# EAGLE design P01R0 (EAGLE 9.6.1)

## Sheet 1 of 2
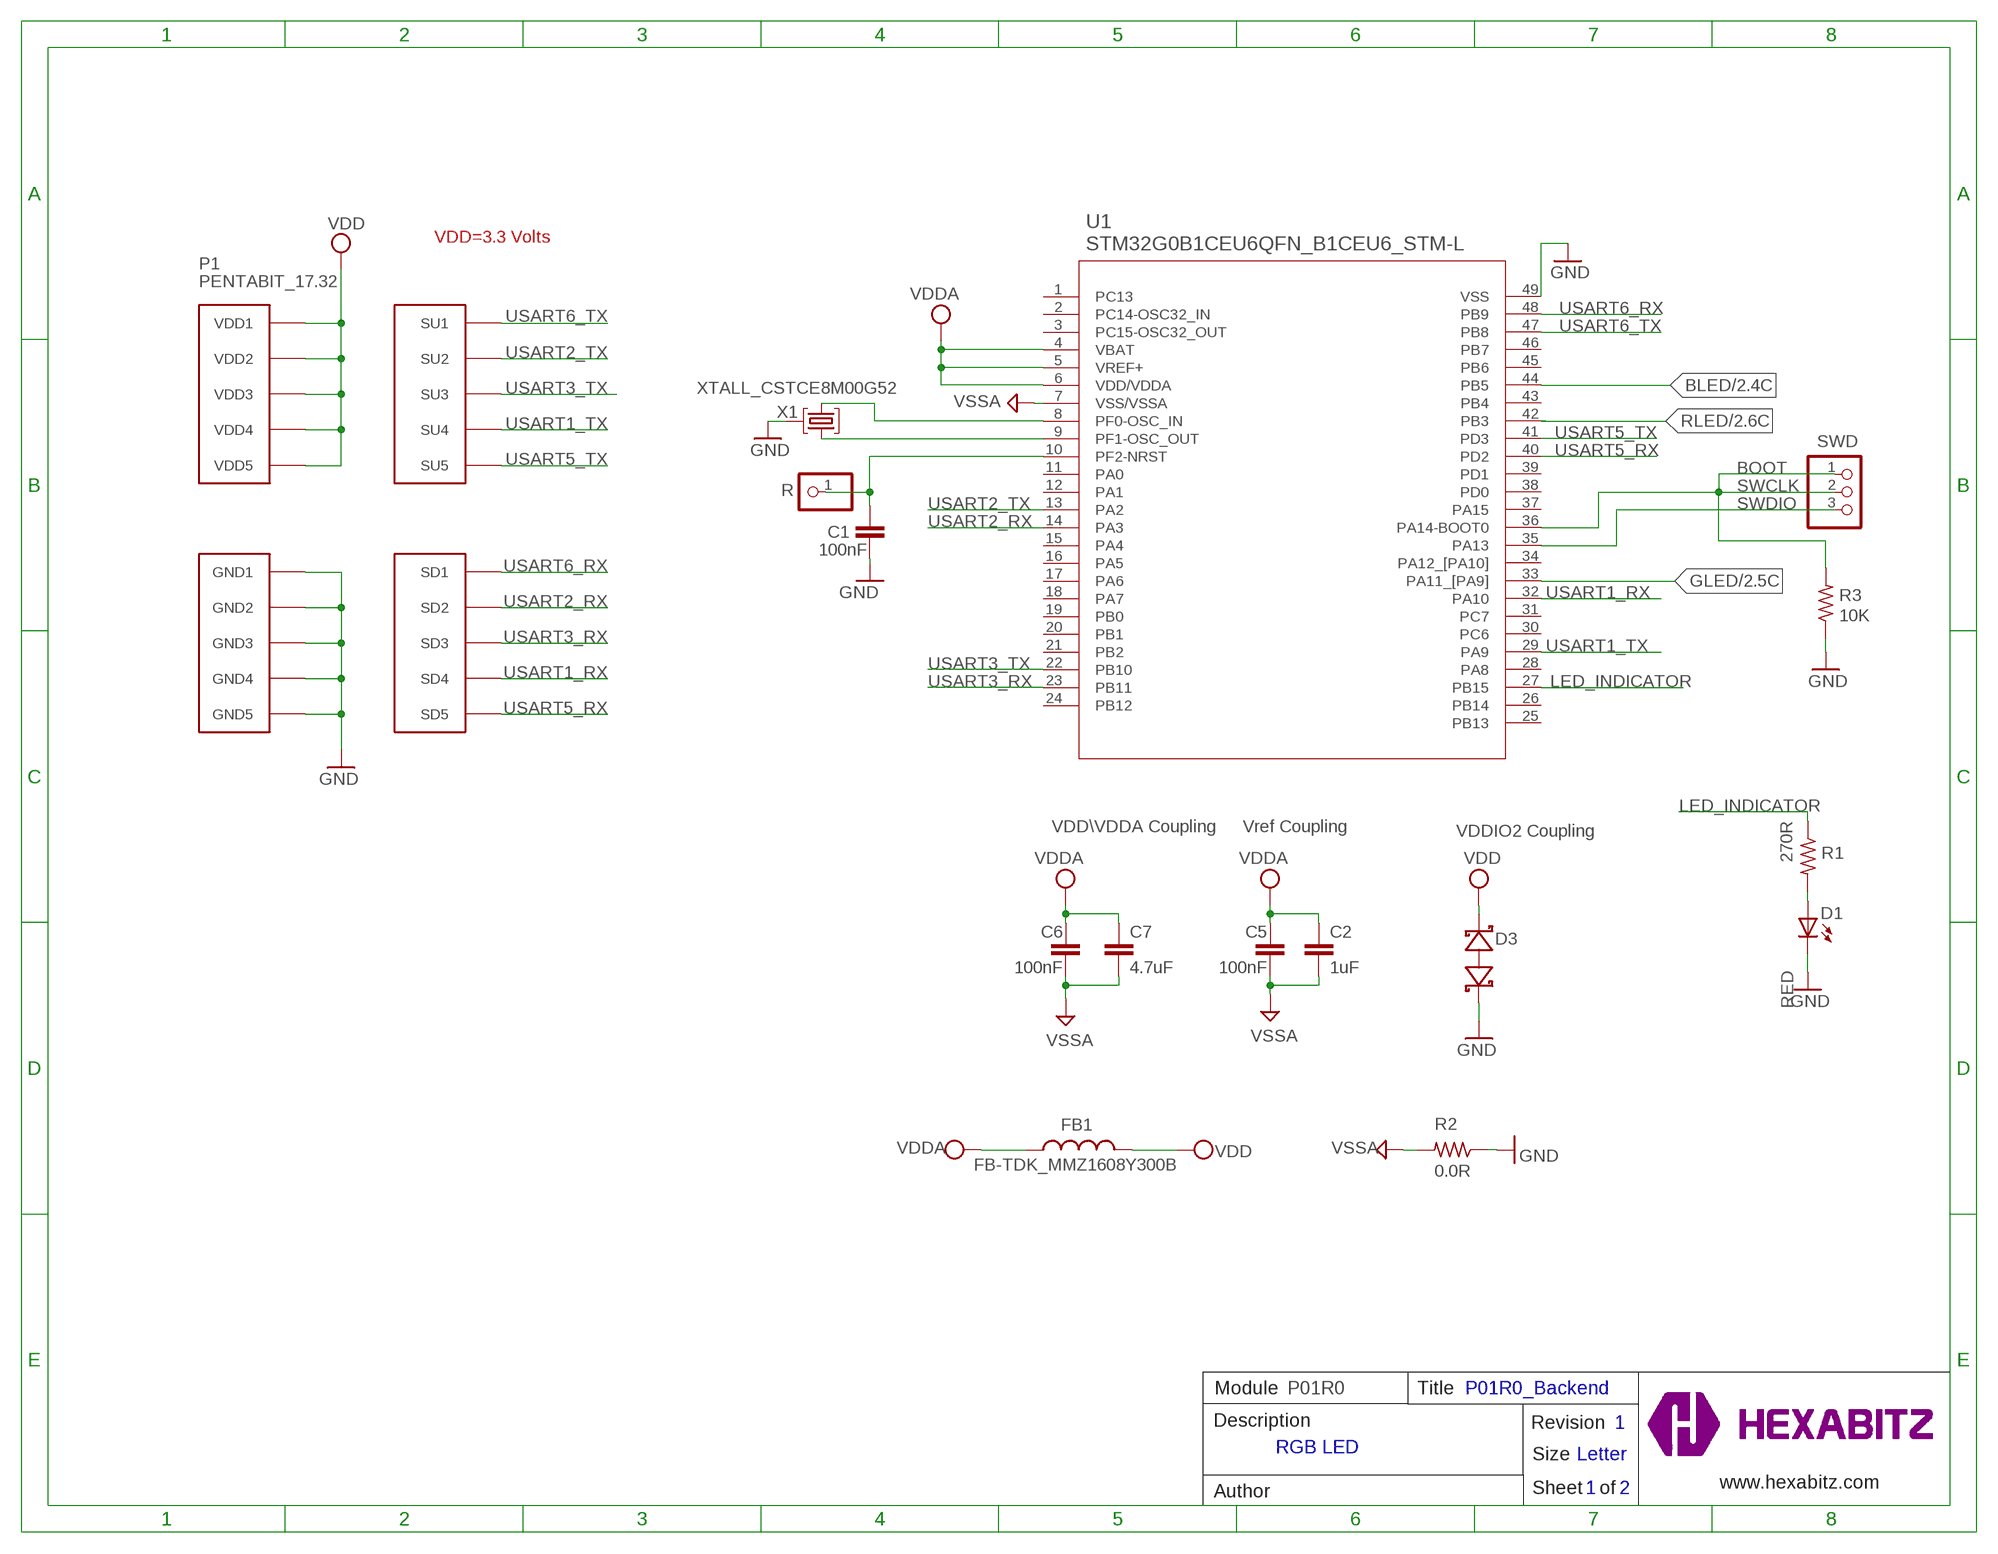
[diagram p0: schematic, sheet 1]

### Parts
C1  100nF  C-0603  [C-0603]
C2  1uF  C-0805  [C-0805]
C5  100nF  C-0603  [C-0603]
C6  100nF  C-0603  [C-0603]
C7  4.7uF  C-0805  [C-0805]
D1  RED  VLMS1300-GS08  [VLMS1300-GS08]
D3  BOURNS_CDSOD323-T03SCBOURNS_CDSOD323-T03SC_0_0  [BOURNS_CDSOD323-T03SC_0]
FB1  FB-TDK_MMZ1608Y300B  FB-0603  [FB-0603]
P1  PENTABIT_17.32  [PENTABIT_17.32]
R  R  PINHD-1X1  [1X01]
R1  270R  R-0603  [R-0603]
R2  0.0R  R-0603  [R-0603]
R3  10K  R-0603  [R-0603]
SWD  PINHD-1X3  [1X03]
U1  STM32G0B1CEU6QFN_B1CEU6_STM-L  [QFN_B1CEU6_STM-L]
X1  XTALL_CSTCE8M00G52  [XTALL_CSTCE8M00G52]

### Nets
BLED: U1.44(PB5) ; also sheet 2
GLED: U1.33(PA11_[PA9]) ; also sheet 2
GND: C1.2 D1.C D3.1(A) P1.PAD_PD6(GND1) P1.PAD_PD7(GND2) P1.PAD_PD8(GND3) P1.PAD_PD9(GND4) P1.PAD_PD10(GND5) R2.1 R3.1 U1.49(VSS) X1.P$2 ; also sheet 2
LED_INDICATOR: R1.1 U1.27(PB15)
N$3: D1.A R1.2
OSC_IN: U1.8(PF0-OSC_IN) X1.P$3
OSC_OUT: U1.9(PF1-OSC_OUT) X1.P$1
R: C1.1 R.1 U1.10(PF2-NRST)
RLED: U1.42(PB3) ; also sheet 2
SWCLK: R3.2 SWD.1 SWD.2 U1.36(PA14-BOOT0)
SWDIO: SWD.3 U1.35(PA13)
USART1_RX: P1.PAD_PD4(SD4) U1.32(PA10)
USART1_TX: P1.PAD_PU4(SU4) U1.29(PA9)
USART2_RX: P1.PAD_PD2(SD2) U1.14(PA3)
USART2_TX: P1.PAD_PU2(SU2) U1.13(PA2)
USART3_RX: P1.PAD_PD3(SD3) U1.23(PB11)
USART3_TX: P1.PAD_PU3(SU3) U1.22(PB10)
USART5_RX: P1.PAD_PD5(SD5) U1.40(PD2)
USART5_TX: P1.PAD_PU5(SU5) U1.41(PD3)
USART6_RX: P1.PAD_PD1(SD1) U1.48(PB9)
USART6_TX: P1.PAD_PU1(SU1) U1.47(PB8)
VDD: D3.2(C) FB1.2 P1.PAD_PU6(VDD1) P1.PAD_PU7(VDD2) P1.PAD_PU8(VDD3) P1.PAD_PU9(VDD4) P1.PAD_PU10(VDD5) ; also sheet 2
VDDA: C2.1 C5.1 C6.1 C7.1 FB1.1 U1.4(VBAT) U1.5(VREF+) U1.6(VDD/VDDA)
VSSA: C2.2 C5.2 C6.2 C7.2 R2.2 U1.7(VSS/VSSA)
Unconnected: U1.1(PC13) U1.2(PC14-OSC32_IN) U1.3(PC15-OSC32_OUT) U1.11(PA0) U1.12(PA1) U1.15(PA4) U1.16(PA5) U1.17(PA6) U1.18(PA7) U1.19(PB0) U1.20(PB1) U1.21(PB2) U1.24(PB12) U1.25(PB13) U1.26(PB14) U1.28(PA8) U1.30(PC6) U1.31(PC7) U1.34(PA12_[PA10]) U1.37(PA15) U1.38(PD0) U1.39(PD1) U1.43(PB4) U1.45(PB6) U1.46(PB7)

### Notes on the sheet
- VDD=3.3 Volts
- BOOT
- VDD\VDDA Coupling | Vref Coupling | VDDIO2 Coupling
- Module | P01R0 | Title | P01R0_Backend
- Description | Revision | 1
- RGB LED
- Size | Letter
- www.hexabitz.com
- Author | Sheet   of | 1 | 2
- C:/Users/Admin/Desktop/logodraft.bmp

## Sheet 2 of 2
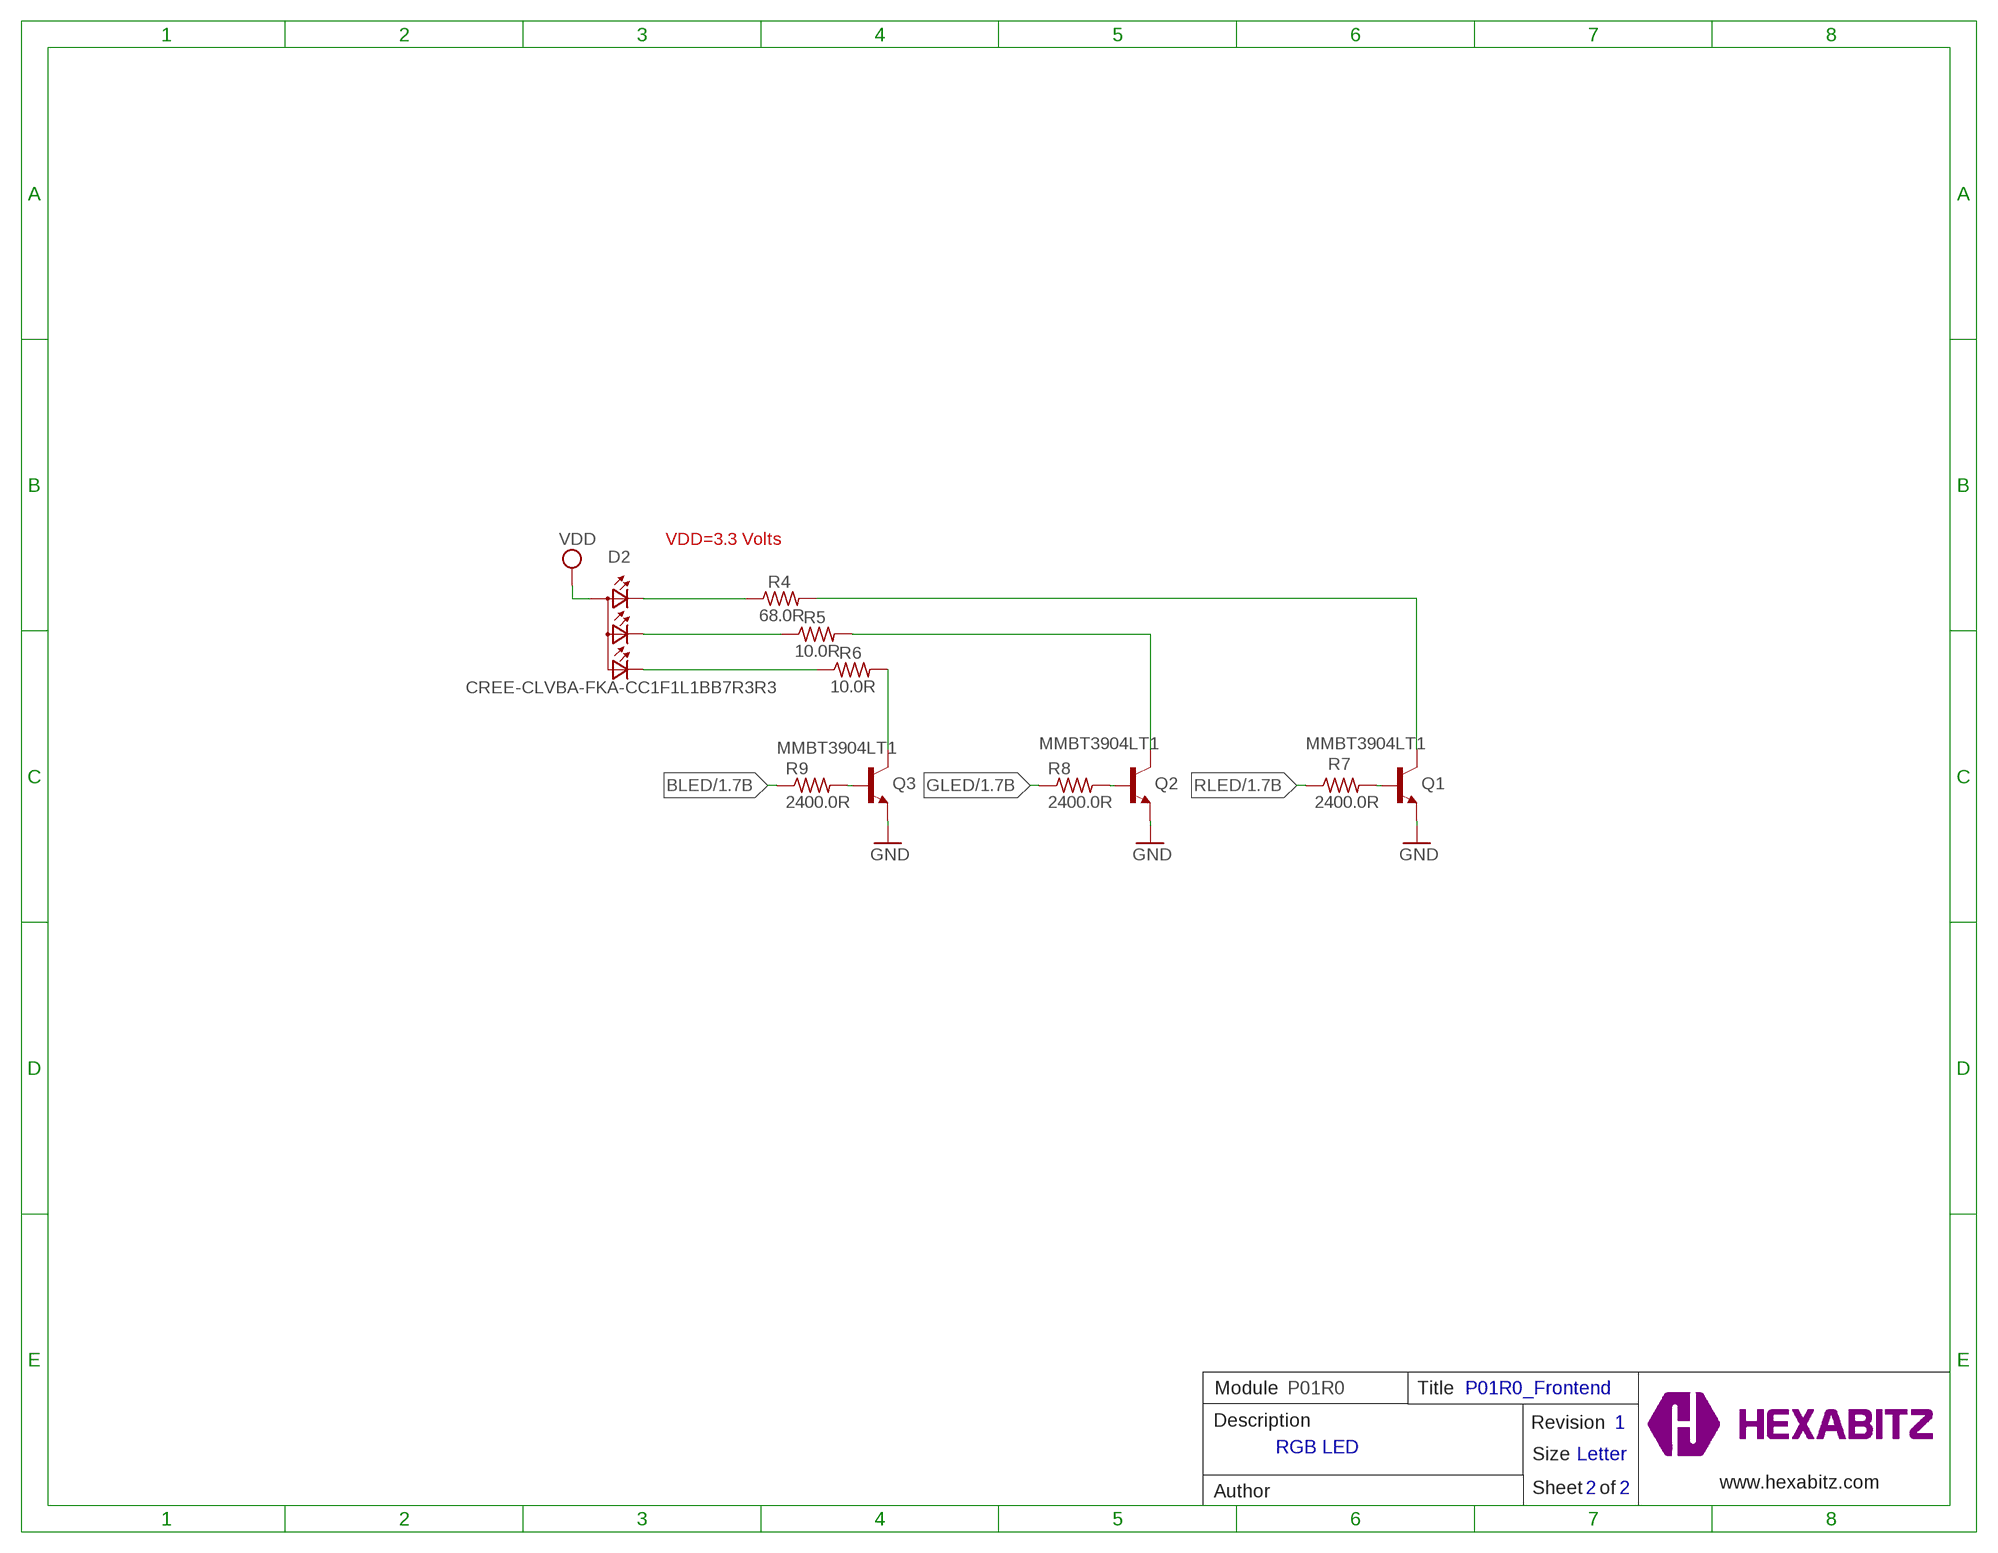
[diagram p1: schematic, sheet 2]

### Parts
D2  CREE-CLVBA-FKA-CC1F1L1BB7R3R3  [PCB-1023943-1]
Q1  MMBT3904LT1  [MMBT3904LT1]
Q2  MMBT3904LT1  [MMBT3904LT1]
Q3  MMBT3904LT1  [MMBT3904LT1]
R4  68.0R  R-0603  [R-0603]
R5  10.0R  R-0603  [R-0603]
R6  10.0R  R-0603  [R-0603]
R7  2400.0R  R-0603  [R-0603]
R8  2400.0R  R-0603  [R-0603]
R9  2400.0R  R-0603  [R-0603]
TRIMBLE-LOGO1  HEXA-LOGO  [HEXA-LOGO]

### Nets
BLED: R9.1 ; also sheet 1
GLED: R8.1 ; also sheet 1
GND: Q1.2(E) Q2.2(E) Q3.2(E) ; also sheet 1
KA_B: D2.P$3(CBLUE) R6.1
KA_G: D2.P$4(CGREEN) R5.1
KA_R: D2.P$1(CRED) R4.1
N$13: Q3.1(B) R9.2
N$14: Q2.1(B) R8.2
N$15: Q1.1(B) R7.2
Q1C: Q1.3(C) R4.2
Q2C: Q2.3(C) R5.2
Q3C: Q3.3(C) R6.2
RLED: R7.1 ; also sheet 1
VDD: D2.P$2(A2) ; also sheet 1

### Notes on the sheet
- VDD=3.3 Volts
- Module | P01R0 | Title | P01R0_Frontend
- Description | Revision | 1
- RGB LED
- Size | Letter
- www.hexabitz.com
- Author | Sheet   of | 2 | 2

## Library data of the parts
C1 C5 C6 = HEXABITZ_RCLS:C-0603: CAP CER 10% X7R 0603
C2 C7 = HEXABITZ_RCLS:C-0805: CAP CER 10% X7R 0805
D1 = Hexabitz:VLMS1300-GS08: Red 0603 130° Clear 54 mcd 2 V Surface Mount ChipLED ; Octopart Url : http://octopart.com/vlms1300-gs08-vishay-21709201; MFN: Vishay; MPN: VLMS1300-GS08; OCTOPART_URL: https://octopart.com/vlms1300-gs08-vishay-21709201?r=sp&s=_gcP4_q8T1SC6PJQPTQ9yA
D2 = Hexabitz:CREE-CLVBA-FKA-CC1F1L1BB7R3R3: CREE CLVBA-FKA-CC1F1L1BB7R3R3 LED, HB, RGB, SMD, 130mW; MFN: Cree, Inc.; MPN: CLVBA-FKA-CC1F1L1BB7R3R3; OCTOPART_URL: https://octopart.com/clvba-fka-cc1f1l1bb7r3r3-cree-20054005
D3 = HEXABITZ_RCLS:BOURNS_CDSOD323-T03SC: CDSOD323-TxxSC - TVS Diode Series; DESCRIPTION: Dio Tvs Vwm 03V 500W Bidir Sod323 / Tape & Reel - 7" Reel; MFN: Bourns; MPN: CDSOD323-T03SC; OCTOPART_URL: https://octopart.com/cdsod323-t03sc-bourns-10487153?r=sp
FB1 = HEXABITZ_RCLS:FB-0603: Ferrite Beads Multi-Layer 0603; MFN: TDK; MPN: MMZ1608Y300B; OCTOPART_URL: https://octopart.com/mmz1608y300b-tdk-368280?r=sp&s=cd9_2ZEqQ9q9UNBuQgHAiA
P1 = hexabitz_connectors:PENTABIT_?: Hexabitz Pentagon Module Connector Pentagon side length = 17.32mm.
Q1 Q2 = HEXABITZ_RCLS:MMBT3904LT1: TRANS NPN 40V 0.2A SOT23; MOUNTING_STYLE: Surface Mount; NUM_OF_PINS: 3; OCTOPART_ID: 0bb6c2bc2200d471; OCTOPART_URL: http://octopart.com/mmbt3904lt1g-on+semiconductor-3280; PACKAGE: SOT-23-3; PACKAGING: Reel; POLARITY: NPN; POWER_DISSIPATION: 0.225W; PRODUCT_CATEGORY: Transistors Bipolar-BJT; SERIES: MMBT3904L; VOLTAGE_RATING_DC: 40.0V
Q3 = HEXABITZ_RCLS:MMBT3904LT1: TRANS NPN 40V 0.2A SOT23; MFN: ON Semiconductor; MOUNTING_STYLE: Surface Mount; MPN: MMBT3904LT1G; NUM_OF_PINS: 3; OCTOPART_ID: 0bb6c2bc2200d471; OCTOPART_URL: http://octopart.com/mmbt3904lt1g-on+semiconductor-3280; PACKAGE: SOT-23-3; PACKAGING: Reel; POLARITY: NPN; POWER_DISSIPATION: 0.225W; PRODUCT_CATEGORY: Transistors Bipolar-BJT; SERIES: MMBT3904L; VOLTAGE_RATING_DC: 40.0V
R = HEXABITZ_USER_INTERFACE_PARTS:PINHD-1X1: PIN HEADER; MFN: TE Connectivity; MPN: 87227-1; OCTOPART_URL: https://octopart.com/87227-1-te+connectivity-39512052?r=sp
R1 R3 = HEXABITZ_RCLS:R-0603: Thick Film Resistors - SMD 0603
R2 = HEXABITZ_RCLS:R-0603: Thick Film Resistors - SMD 0603; MFN: Yageo; MPN: RC0603JR-070RL; OCTOPART_URL: https://octopart.com/rc0603jr-070rl-yageo-1241539?r=sp&s=X2NteqRjRNWrnx42Y0aliA; RESISTANCE: 0.0 Ohm
R4 = HEXABITZ_RCLS:R-0603: Thick Film Resistors - SMD 0603; MFN: Vishay; MPN: CRCW060368R0FKEA; OCTOPART_URL: https://octopart.com/crcw060368r0fkea-vishay-39811903; RESISTANCE: 68.0 Ω; SPICEPREFIX: R; TOLERANCE: 1%
R5 R6 = HEXABITZ_RCLS:R-0603: Thick Film Resistors - SMD 0603; MFN: Vishay; MPN: CRCW060310R0FKEB; OCTOPART_URL: https://octopart.com/crcw060310r0fkeb-vishay-42507905; RESISTANCE: 10.0 Ω; TOLERANCE: 1%
R7-R9 = HEXABITZ_RCLS:R-0603: Thick Film Resistors - SMD 0603; MFN: Vishay; MPN: CRCW06032K40JNEA; OCTOPART_URL: https://octopart.com/crcw06032k40jnea-vishay-40298967; RESISTANCE: 2400.0 Ω; TOLERANCE: 5%
SWD = HEXABITZ_CONNECTION_PARTS:PINHD-1X3: PIN HEADER
TRIMBLE-LOGO1 = HEXABITZ_USER_INTERFACE_PARTS:HEXA-LOGO: Trimble-Logo
U1 = HEXABITZ_ICs:STM32G0B1CEU6; COPYRIGHT: Copyright (C) 2021 Ultra Librarian. All rights reserved.; MANUFACTURER_PART_NUMBER: STM32G0B1CEU6; MFR_NAME: STMicroelectronics
X1 = Hexabitz:XTALL_CSTCE8M00G52: MURATA CSTCE8M00G52-R0 RESONATOR, SMD, 8MHZ ; Octopart Url : https://octopart.com/cstce8m00g52-r0-murata-7145559; MFN: Murata; MPN: CSTCE8M00G52Z-R0; OCTOPART_URL: https://octopart.com/cstce8m00g52z-r0-murata-17755941?r=sp&s=JDnNJnrHQhyS8Zk4ofFWXw

## Board
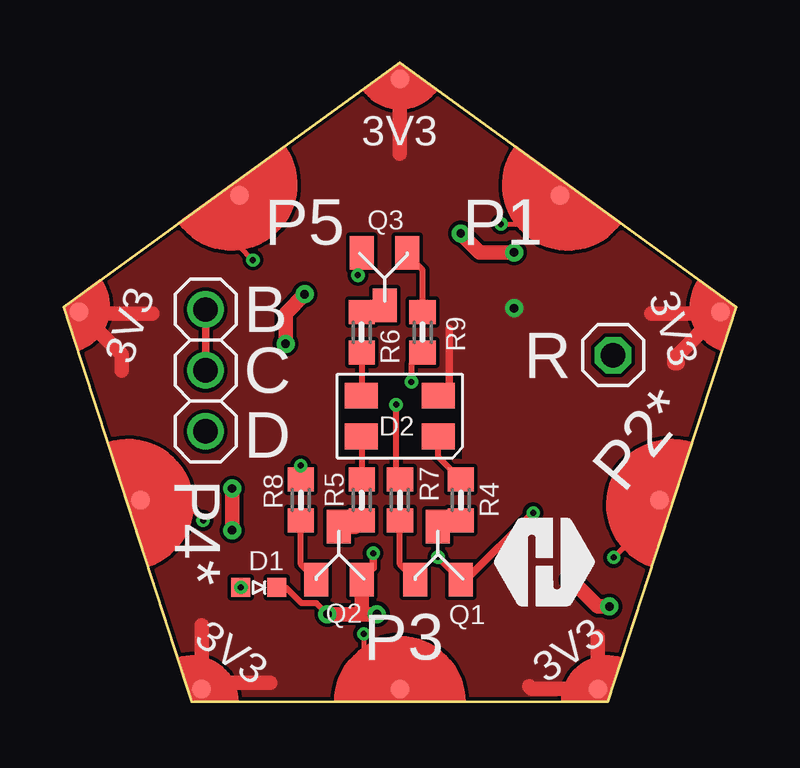
[diagram p2: board, top side]
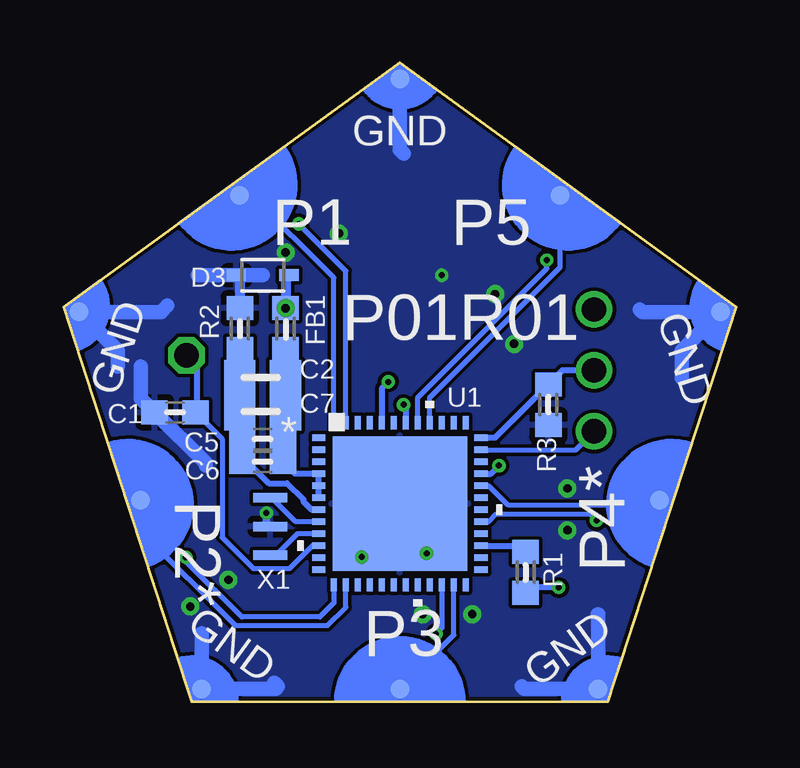
[diagram p3: board, bottom side, seen from below]

Size 28.02 x 26.65 mm. Coordinates in mm from the lower left corner, seen from the top.
Copper layers (1*16): Top 0.035mm / dielectric 1.5mm / Bottom 0.035mm
Design rules "Ibrahim *": minimum track width 6mil, minimum drill 0.25mm, track to track 6mil, track to pad 6mil, pad to pad 6mil, via to via 6mil, smd to smd 0mil, copper to edge 0.15mm, drill to drill 6mil, minimum pad ring 10mil, minimum via ring 6mil, stop-mask expansion 4mil, vias tented up to drill 24mil, thermal gap 10mil

### Footprints (pad centres in the part's own frame; a part is rotated, then mirrored left to right if it is on the bottom)
C-0603 = smd 1.1 x 1: 1 -0.85,0; 2 0.85,0
C-0805 = smd 1.3 x 1.5: 1 -0.95,0; 2 0.95,0
VLMS1300-GS08 = smd 0.8 x 0.8: A 0,0.75; C 0,-0.75
PCB-1023943-1 = smd 1.378 x 1.08: P$1 -1.604,0.85; P$2 -1.604,-0.85; P$3 1.604,-0.85; P$4 1.604,0.85
BOURNS_CDSOD323-T03SC_0 = smd 0.8 x 0.5: 1 -1.1,0; 2 1.1,0
FB-0603 = smd 1 x 1.1: 1 -0.85,0; 2 0.85,0
PENTABIT_17.32 = smd 0.8 x 0.8 bottom: PAD_PD1 6.68,9.2; PAD_PD2 10.81,-3.51; PAD_PD3 0,-11.37; PAD_PD4 -10.81,-3.51; PAD_PD5 -6.68,9.2; PAD_PD6 0,14.05; PAD_PD7 13.36,4.34; PAD_PD8 8.26,-11.37; PAD_PD9 -8.26,-11.37; PAD_PD10 -13.36,4.34 | smd 0.8 x 0.8: PAD_PU1 6.68,9.2; PAD_PU2 10.81,-3.51; PAD_PU3 0,-11.37; PAD_PU4 -10.81,-3.51; PAD_PU5 -6.68,9.2; PAD_PU6 0,14.05; PAD_PU7 13.36,4.34; PAD_PU8 8.26,-11.37; PAD_PU9 -8.26,-11.37; PAD_PU10 -13.36,4.34
MMBT3904LT1 = smd 1 x 1.4: 1 -0.95,-1.1; 2 0.95,-1.1; 3 0,1.1
1X01 = drill 1.016 octagon: 1 0,0
R-0603 = smd 1 x 1.1: 1 -0.85,0; 2 0.85,0
1X03 = drill 1.016: 1 -2.54,0; 2 0,0; 3 2.54,0
QFN_B1CEU6_STM-L = smd 0.55 x 0.254: 1 -3.38,2.751; 2 -3.38,2.251; 3 -3.38,1.75; 4 -3.38,1.25; 5 -3.38,0.75; 6 -3.38,0.25; 7 -3.38,-0.25; 8 -3.38,-0.75; 9 -3.38,-1.25; 10 -3.38,-1.75; 11 -3.38,-2.251; 12 -3.38,-2.751; 25 3.38,-2.751; 26 3.38,-2.251; 27 3.38,-1.75; 28 3.38,-1.25; 29 3.38,-0.75; 30 3.38,-0.25; 31 3.38,0.25; 32 3.38,0.75; 33 3.38,1.25; 34 3.38,1.75; 35 3.38,2.251; 36 3.38,2.751 | smd 0.254 x 0.55: 13 -2.751,-3.38; 14 -2.251,-3.38; 15 -1.75,-3.38; 16 -1.25,-3.38; 17 -0.75,-3.38; 18 -0.25,-3.38; 19 0.25,-3.38; 20 0.75,-3.38; 21 1.25,-3.38; 22 1.75,-3.38; 23 2.251,-3.38; 24 2.751,-3.38; 37 2.751,3.38; 38 2.251,3.38; 39 1.75,3.38; 40 1.25,3.38; 41 0.75,3.38; 42 0.25,3.38; 43 -0.25,3.38; 44 -0.75,3.38; 45 -1.25,3.38; 46 -1.75,3.38; 47 -2.251,3.38; 48 -2.751,3.38 | smd 5.6 x 5.6: 49 0,0
XTALL_CSTCE8M00G52 = smd 1.4 x 0.4: P$1 0,1.2; P$2 0,0; P$3 0,-1.2

### Placement (x,y rotation side)
C1  23.38,12.08 180 bottom
C2  19.73,13.51 180 bottom
C5  19.73,10.97 180 bottom
C6  19.73,10.02 180 bottom
C7  19.73,12.08 180 bottom
D1  8.14,4.78 90 top
D2  14.01,11.92 180 top
D3  19.73,17.79 0 bottom
FB1  18.77,15.57 90 bottom
P1  14.01,11.92 0 top
Q1  15.6,6.21 0 top
Q2  11.47,6.21 0 top
Q3  13.38,17.63 180 top
R  22.9,14.46 0 top
R1  8.77,5.41 270 bottom
R2  20.68,15.57 270 bottom
R3  7.82,12.4 90 bottom
R4  16.55,8.43 270 top
R5  12.42,8.43 270 top
R6  12.42,15.41 90 top
R7  14.01,8.43 270 top
R8  9.88,8.43 270 top
R9  14.96,15.41 90 top
SWD  5.91,13.82 270 top
TRIMBLE-LOGO1  20.04,3.98 0 top
U1  14.01,8.27 0 bottom
X1  19.41,7.32 180 bottom

### Tracks (layer width: path | path; a pad name or v marks a point on that pad's centre or on a via)
BLED  (via drill 0.25 pad 0.55)
  Top 0.254: R9.1 14.49,14.09 v14.49,13.35
  Bottom 0.254: v14.49,13.35 14.76,13.08 U1.44
GLED  (via drill 0.25 pad 0.55)
  Top 0.254: R8.1 v9.88,9.86
  Bottom 0.254: U1.33 10.22,9.52 v9.88,9.86
GND  (via drill 0.25 pad 0.55, 0.35 pad 0.75)
  Top 0.254: Q2.2 12.9,5.58 | v15.61,6.05 v15.6,6.05 | v10.99,3.66 10.53,4.13 9.9,4.13 9.25,4.78 D1.C
  Top 0.305: 12.9,5.58 v12.9,6.2 | v15.61,6.05 Q1.2 16.79,5.1 v19.57,7.89 | Q3.2 12.26,18.57 v12.26,17.79
  Top 0.61: v9.25,14.94 9.25,16.21 v10.04,17 | v7.02,8.9 v7.02,7.16 | v18.77,18.75 17.34,18.75 v16.55,19.54 | v22.74,3.98 22.27,3.98 v21.15,5.09 | v13.06,3.66 12.42,3.66 | 12.42,3.66 v10.99,3.66 | Q2.2 12.42,3.66
  Bottom 0.305: X1.P$2 19.57,7.47 v19.57,7.89
  Bottom 0.406: D3.1 20.68,17.65 R2.1
  Bottom 0.61: 5.75,3.66 P1.PAD_PD9 8.83,0.55 8.93,0.65 | 4.01,16.36 3.9,16.26 P1.PAD_PD10 2.26,14.65 2.26,13.51 | 23.69,16.52 23.96,16.26 P1.PAD_PD7 25.76,14.65 25.76,13.98 | P1.PAD_PD6 14.01,23.03 13.85,22.87 | 19.25,0.81 19.09,0.65 19.19,0.55 P1.PAD_PD8 22.27,2.87 | v12.9,6.2 14.01,7.32 U1.49 15.6,6.68 v15.6,6.05 | 19.73,17.79 D3.1 22.42,17.79 | 24.8,13.98 24.8,12.66 C1.2 22.11,9.96 22.11,9.86
  pour Bottom (rank 2): 5.28,0.01 22.58,0.01 27.99,16.4 14.01,26.68 -0.01,16.53
KA_B
  Top 0.254: R6.1 12.42,12.79 D2.P$3
KA_G
  Top 0.254: D2.P$4 12.42,11.05 R5.1
KA_R
  Top 0.254: R4.1 15.61,10.21 D2.P$1
LED_INDICATOR
  Bottom 0.254: U1.27 9.03,6.52 R1.1
N$3  (via drill 0.25 pad 0.55)
  Bottom 0.254: D1.A 8.56,4.78 R1.2
  other vias: 7.39,4.78
N$13
  Top 0.254: R9.2 14.96,18.01 14.32,18.65 Q3.1
N$14
  Top 0.254: Q2.1 9.88,5.74 R8.2
N$15
  Top 0.254: Q1.1 14.01,5.74 R7.2
OSC_IN
  Bottom 0.203: U1.8 18.34,7.52 19.34,8.52 X1.P$3
OSC_OUT
  Bottom 0.203: U1.9 18.28,7.02 19.21,6.08 19.25,6.12 X1.P$1
Q1C
  Top 0.254: Q1.3 15.87,7.58 R4.2
Q2C
  Top 0.61: R5.2 12.15,7.3 Q2.3
Q3C
  Top 0.254: R6.2 12.7,16.53 Q3.3
R
  Bottom 0.203: C1.1 22.48,12.03 21.41,10.97 21.41,6.86 20.12,5.57 18.6,5.57 17.61,6.56 17.43,6.56 U1.10
  Bottom 0.254: R.1 22.48,14.03 22.48,12.03
RLED  (via drill 0.25 pad 0.55)
  Top 0.254: R7.1 13.85,9.44 v13.85,12.4
  Bottom 0.254: v13.85,12.4 13.76,12.3 U1.42
SWCLK
  Top 0.305: SWD.1 SWD.2
  Bottom 0.254: SWD.2 7.24,13.82 R3.2 10.05,11.02 U1.36
SWDIO
  Bottom 0.203: U1.35 6.68,10.52 SWD.3
USART1_RX
  Bottom 0.203: U1.32 10.31,9.02 9.52,8.22 3.38,8.22 P1.PAD_PD4
USART1_TX  (via drill 0.25 pad 0.55)
  Top 0.203: v5.81,7.57 4.97,8.41 P1.PAD_PU4
  Bottom 0.203: U1.29 10.31,7.52 10,7.84 6.07,7.84 v5.81,7.57
USART2_RX
  Bottom 0.203: P1.PAD_PD2 24.82,7.14 20.87,3.19 17.03,3.19 16.26,3.95 U1.14
USART2_TX  (via drill 0.25 pad 0.55)
  Top 0.203: P1.PAD_PU2 24.82,7.93 v22.92,6.03
  Bottom 0.203: U1.13 16.76,4.13 17.34,3.54 20.6,3.54 22.92,5.87 v22.92,6.03
USART3_RX
  Bottom 0.203: P1.PAD_PD3 11.76,2.8 U1.23
USART3_TX  (via drill 0.25 pad 0.55)
  Top 0.203: v12.5,2.84 12.5,2.06 P1.PAD_PU3
  Bottom 0.203: U1.22 12.26,3.09 v12.5,2.84
USART5_RX
  Bottom 0.203: U1.40 12.76,12.7 7.33,18.13 P1.PAD_PD5
USART5_TX  (via drill 0.25 pad 0.55)
  Top 0.203: v7.89,18.43 7.33,18.98 P1.PAD_PU5
  Bottom 0.203: v7.89,18.43 7.89,18.08 13.26,12.7 U1.41
USART6_RX
  Bottom 0.203: U1.48 16.76,17.69 20.19,21.12 P1.PAD_PD1
USART6_TX  (via drill 0.25 pad 0.55)
  Top 0.203: v18.22,19.93 19.5,19.93 P1.PAD_PU1
  Bottom 0.203: U1.47 16.26,17.97 v18.22,19.93
VDD  (via drill 0.35 pad 0.75)
  Top 0.305: D2.P$2 16.07,13.23 16.07,15.57
  Top 0.61: 3.69,16.21 0.7,16.21 P1.PAD_PU10 2.42,14.49 2.42,13.82 | P1.PAD_PU6 14.01,22.87 | 24.49,16.21 27.32,16.21 P1.PAD_PU7 25.44,14.33 25.44,14.14 25.6,14.14 | 19.41,0.65 19.51,0.55 P1.PAD_PU8 22.27,2.71 | 5.75,3.19 5.75,3.18 P1.PAD_PU9 6.01,0.81 8.61,0.81
  Bottom 0.406: FB1.2 18.77,17.65 D3.2
  other vias: 18.77,16.42
  pour Top (rank 2): 5.33,0.01 22.69,0.01 27.99,16.4 13.98,26.7 0.02,16.43
  cutout Top: 11.47,13.67 16.55,13.67 16.55,10.17 11.47,10.17
VDDA
  Bottom 0.254: U1.6 U1.5 U1.4 18.38,9.52 C6.1 | 18.77,11.07 C5.1
  Bottom 0.61: FB1.1 C2.1 C7.1 18.77,11.07 | C5.1 C6.1
VSSA
  Bottom 0.254: C7.2 20.68,11.07 C5.2 | C6.2 20.37,10.01 19.47,9.12 18.71,9.12 18.03,8.44 18.03,8.36 17.69,8.02 U1.7
  Bottom 0.61: R2.2 C2.2 C7.2 | C5.2 C6.2

### Text on the board
tPlace: 3V3 | P5 | P1 | 3V3 | 3V3 | P2* | P4* | P3 | 3V3 | 3V3
bPlace: GND | P5 | P1 | P01R01 | GND | GND | P4* | P2* | P3 | GND | GND
tNames: B | R | C | D